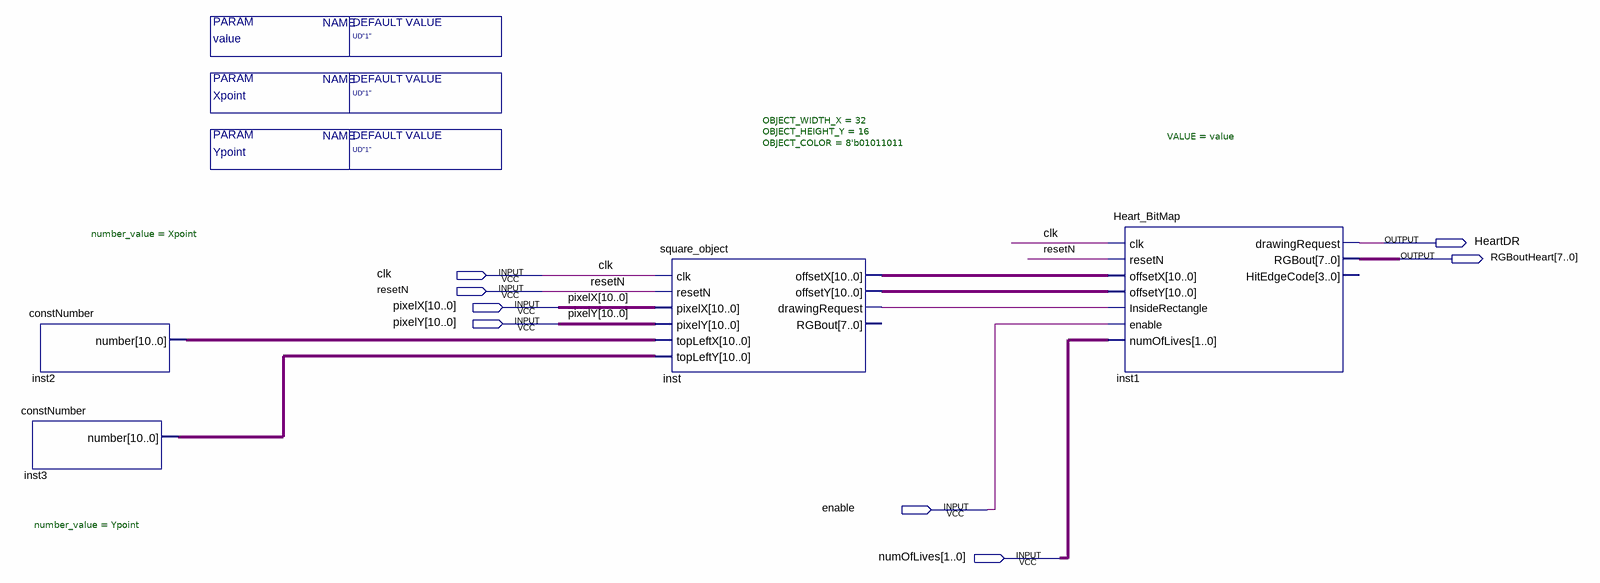
[diagram p0: schematic sheet]
// Quartus schematic HeartBlock.bdf as structural Verilog: 4 symbols, 8 pins
module HeartBlock #(parameter value = "UD\"1\"", parameter Xpoint = "UD\"1\"", parameter Ypoint = "UD\"1\"") (
  input  clk,
  input  resetN,
  input  [10:0] pixelX,
  input  [10:0] pixelY,
  input  enable,
  input  [1:0] numOfLives,
  output HeartDR,
  output [7:0] RGBoutHeart
);

  wire inst_drawingrequest;
  wire [10:0] inst2_number, inst3_number, inst_offsetx, inst_offsety;

  constNumber #(.number_value(Xpoint)) inst2 (.number(inst2_number));
  constNumber #(.number_value(Ypoint)) inst3 (.number(inst3_number));
  square_object #(.OBJECT_WIDTH_X(32), .OBJECT_HEIGHT_Y(16), .OBJECT_COLOR(8'b01011011)) inst (
    .clk(clk), .resetN(resetN), .pixelX(pixelX), .pixelY(pixelY), .topLeftX(inst2_number),
    .topLeftY(inst3_number), .offsetX(inst_offsetx), .offsetY(inst_offsety),
    .drawingRequest(inst_drawingrequest));  // open: RGBout
  Heart_BitMap #(.VALUE(value)) inst1 (
    .clk(clk), .resetN(resetN), .offsetX(inst_offsetx), .offsetY(inst_offsety),
    .InsideRectangle(inst_drawingrequest), .enable(enable), .numOfLives(numOfLives),
    .drawingRequest(HeartDR), .RGBout(RGBoutHeart));  // open: HitEdgeCode
endmodule
